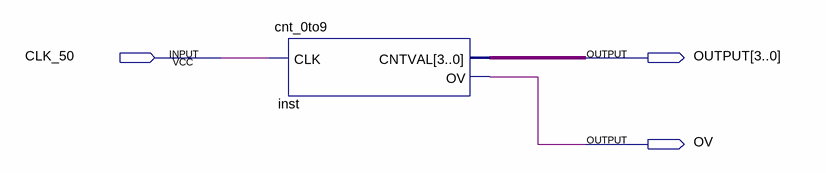
[diagram p0: schematic sheet]
// Quartus schematic start_3.bdf as structural Verilog: 1 symbols, 3 pins
module start_3 (
  input  CLK_50,
  output [3:0] OUTPUT,
  output OV
);

  cnt_0to9 inst (.CLK(CLK_50), .CNTVAL(OUTPUT), .OV(OV));
endmodule
